# Altium schematic sheet CATS-EUROC-GNSS.SchDoc: CATS EuRoC Edition
size A4; Author: Luca Jost; Revision: V1.0; SheetNumber: 16; SheetTotal: 16; Subtitle: GNSS
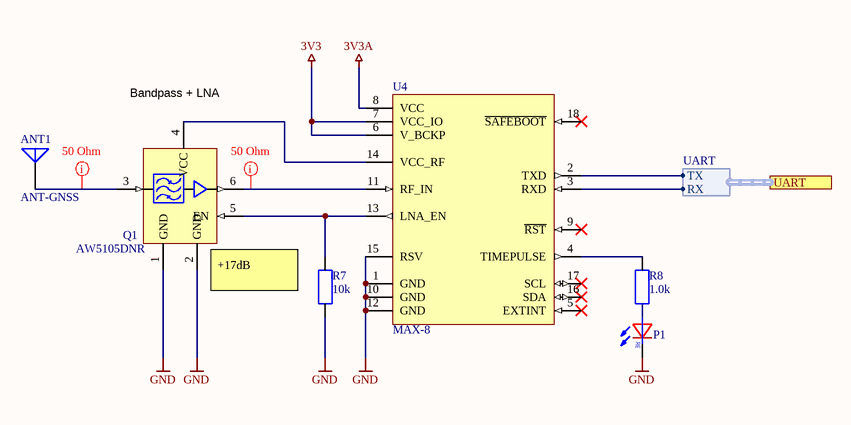
[diagram p0: CATS-EUROC-GNSS.SchDoc]

## Parts
ANT1  ANT-GNSS  [THT Antenna GNSS 18x18]
P1  LED  [SMD LED 0603]  (value not drawn)
Q1  AW5105DNR  [SMD LNA AW5105DNR]
R7  10k  [SMD Widerstand 0402]
R8  1.0k  [SMD Widerstand 0402]
U4  MAX-8  [SMD MAX-8]

## Ports
UART (harness UART)

## Harnesses
UART: TX, RX

## Nets
3V3: U4.6(V_BCKP) U4.7(VCC_IO)
3V3A: U4.8(VCC)
GND: P1.K Q1.1(GND) Q1.2(GND) R7.1 U4.1(GND) U4.10(GND) U4.12(GND) U4.15(RSV)
NetANT1_1: ANT1.1 Q1.3
NetP1_A: P1.A R8.1
NetQ1_4: Q1.4(VCC) U4.14(VCC_RF)
NetQ1_5: Q1.5(EN) R7.2 U4.13(LNA_EN)
NetQ1_6: Q1.6(EN) U4.11(RF_IN)
NetR8_2: R8.2 U4.4(TIMEPULSE)
NetU4_2: U4.2(TXD) ; port UART.TX
NetU4_3: U4.3(RXD) ; port UART.RX

Not connected (* = marked no-connect by the designer): U4 5(EXTINT)* 9(~{RST})* 16(SDA)* 17(SCL)* 18(~{SAFEBOOT})*

## Layout directives
rule Impedance Constraint [Min = 50.00    Max = 50.00    ]; net class RF-Line 50: NetANT1_1, NetQ1_6

## Notes on the sheet
- (near Q1) Bandpass + LNA
- (near Q1) +17dB
- Title
- Author:
- Subtitle
- Date:
- Rev:
- File:
- Sheet
- of
- (in symbol LED) RE

## Library data of the parts
ANT1 = ANT-GNSS: 1.575GHz GPS Ceramic Patch RF Antenna 1.573GHz ~ 1.577GHz 3.3dBic Pin Adhesive; ComponentLink1Description: Datasheet; ComponentLink1URL: https://abracon.com/patchantenna/APAE1575R1820ABDC1-T.pdf; Digikey: 535-11944-ND
P1 = LED: Color LED
Q1 = AW5105DNR: BDS/GPS/GNSS INTEGRATED FRONT-END MODULE WITH / LOW NOISE AMPLIFIER AND FILTER; ComponentLink1Description: Datasheet; ComponentLink1URL: https://datasheet.lcsc.com/lcsc/2008041805_AWINIC-Shanghai-Awinic-Tech-AW5105DNR_C506193.pdf; JLC: C506193
R7 = E24 - 10k: SMD Chip Resistor E24; Unit Price: 0.01; Number: -; Supplier: -; JLC: C25744
R8 = E24 - 1.0k: SMD Chip Resistor E24; Unit Price: 0.01; Number: -; Supplier: -; JLC: C11702
U4 = MAX-8: u-blox 8 GNSS modules; ComponentLink1Description: Datasheet; ComponentLink1URL: https://www.u-blox.com/sites/default/files/MAX-8_DataSheet_%28UBX-16000093%29.pdf; JLC: C90770; Digikey: 672-MAX-8C-0TR-ND